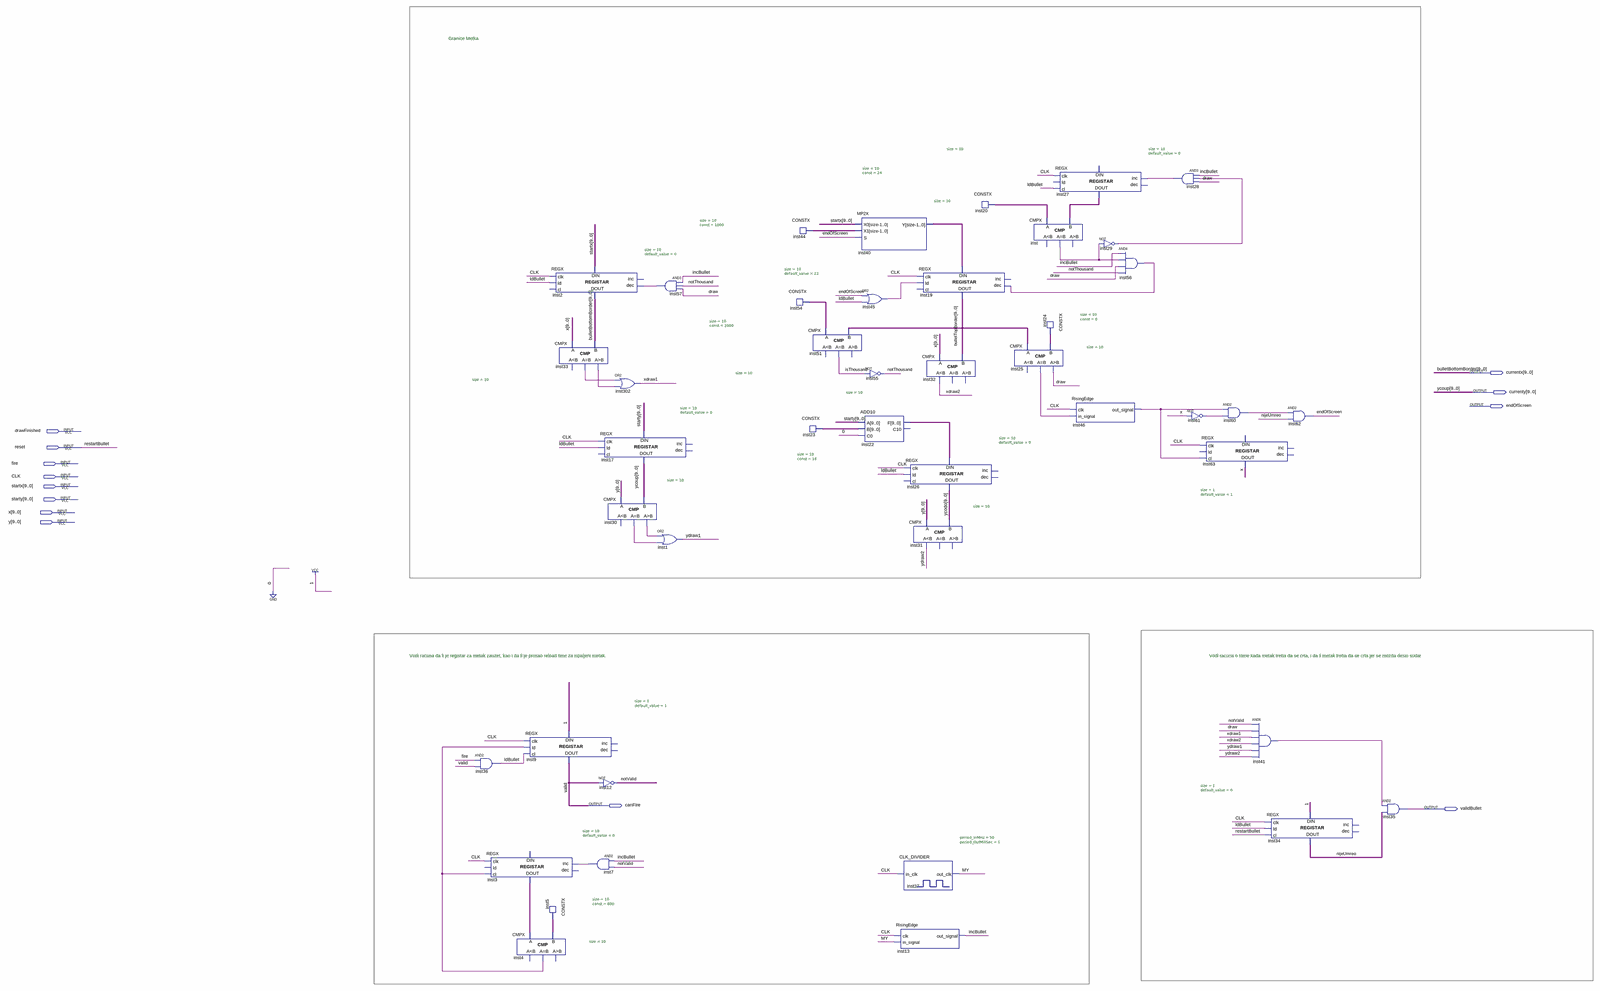
[diagram p0: schematic sheet, whole]
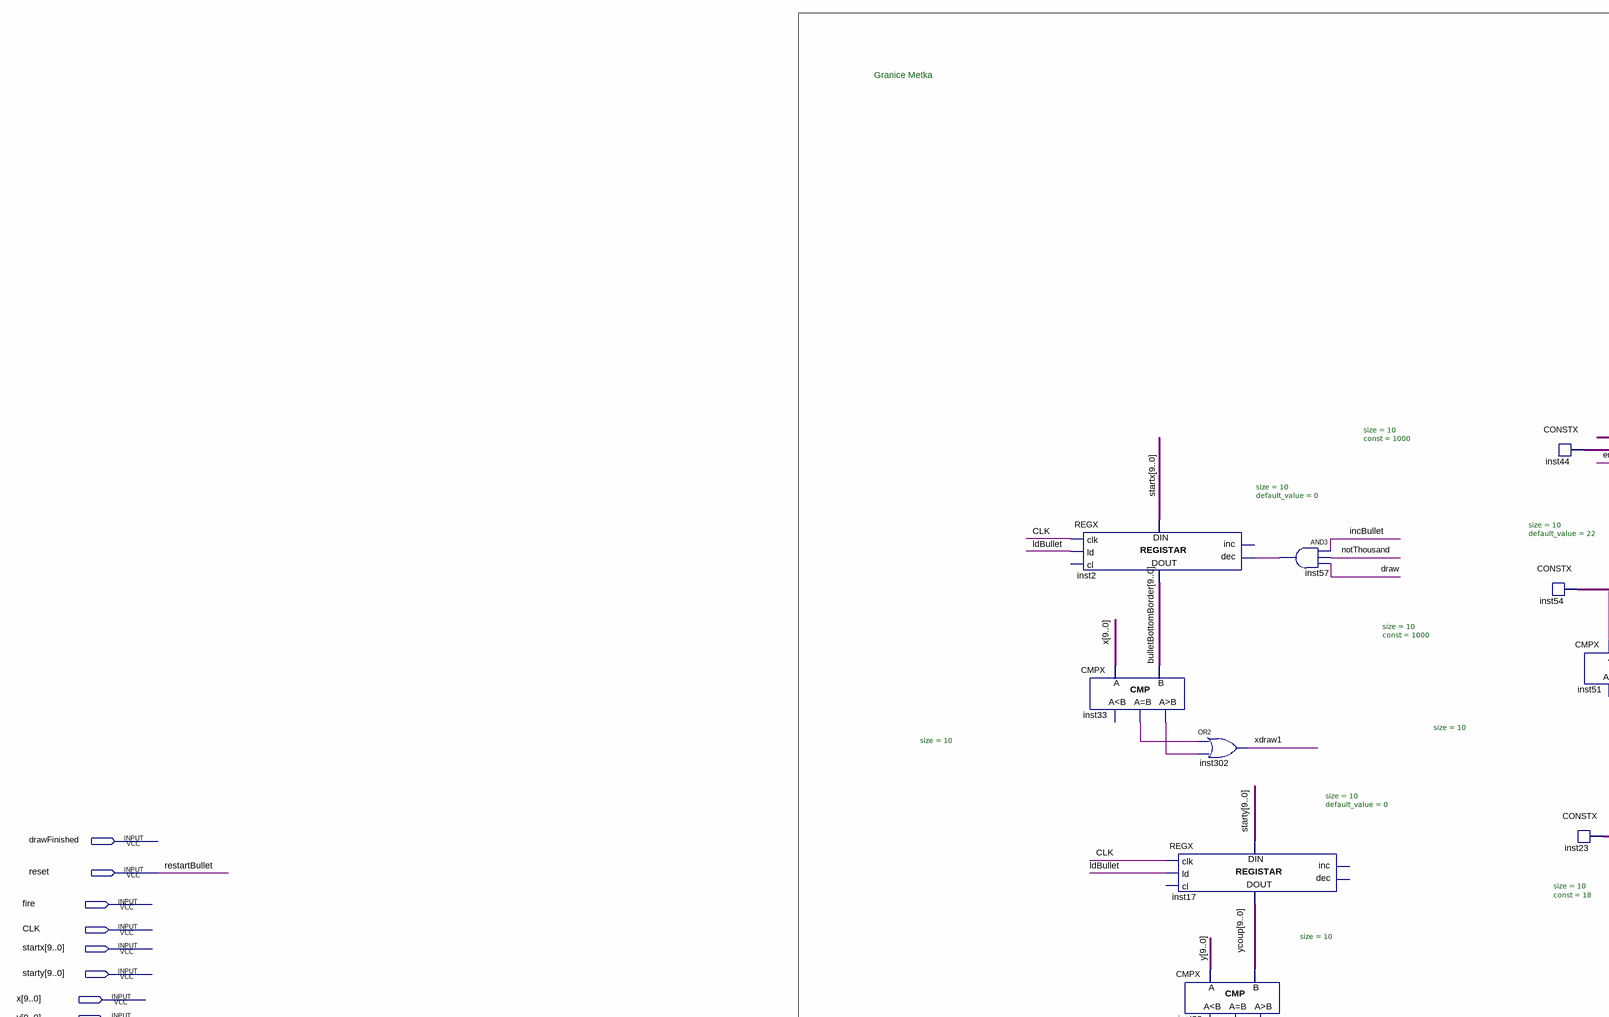
[diagram p1: schematic sheet, upper left part]
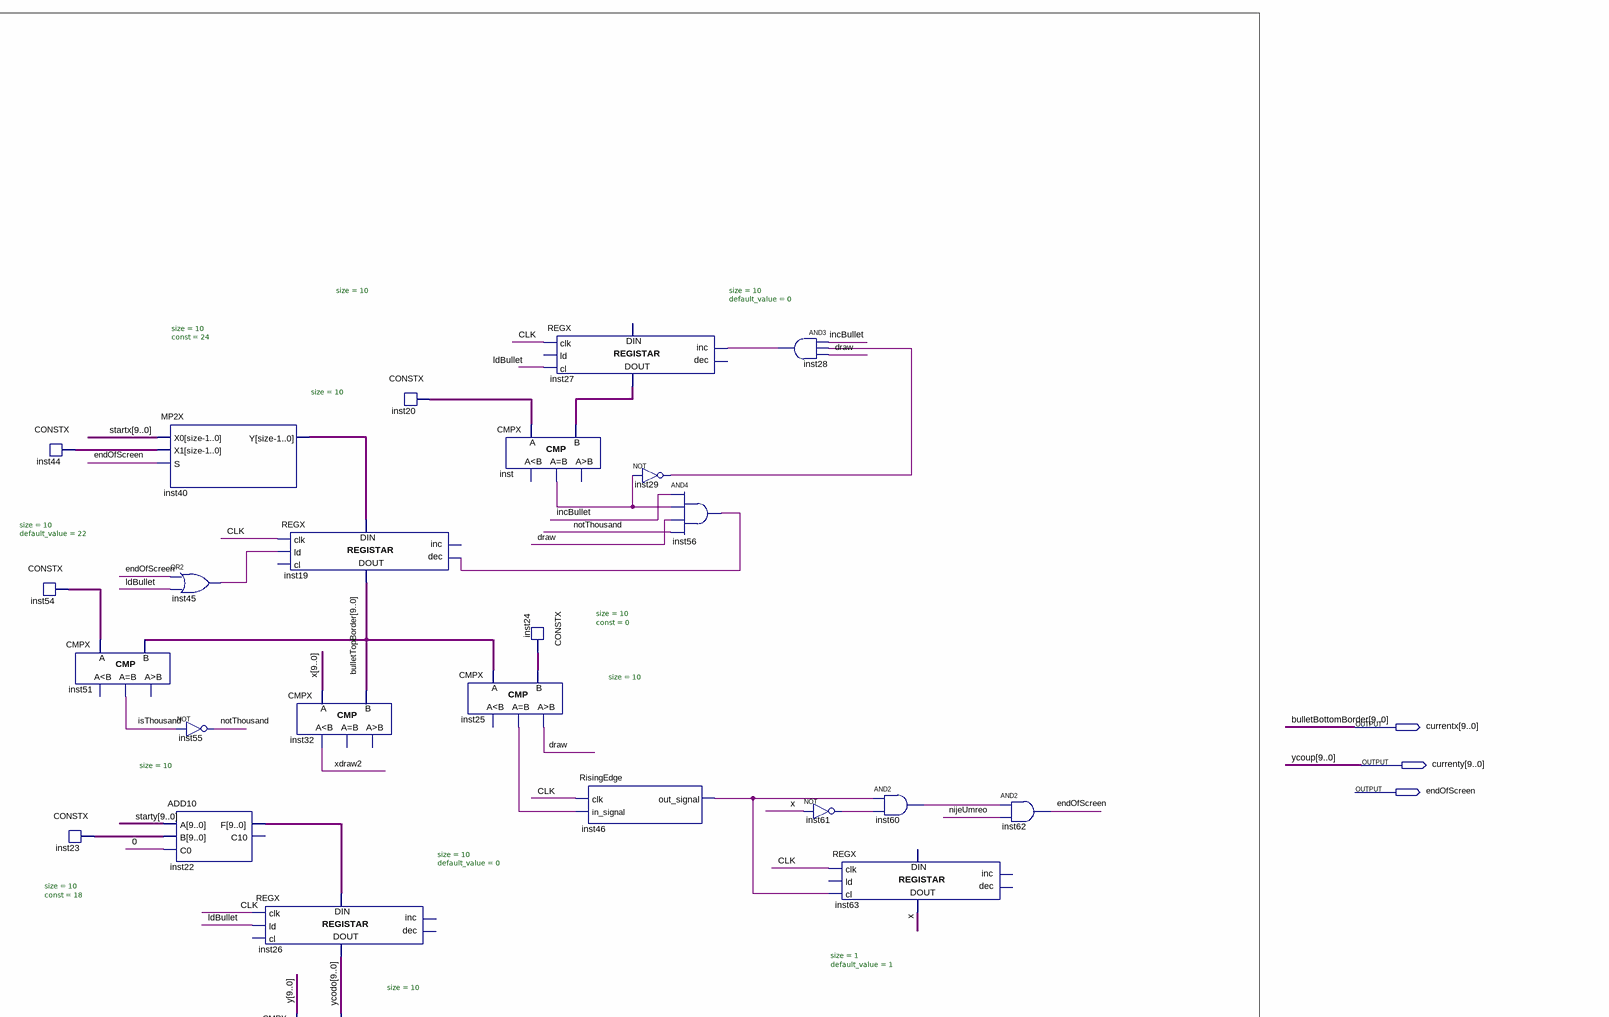
[diagram p2: schematic sheet, upper right part]
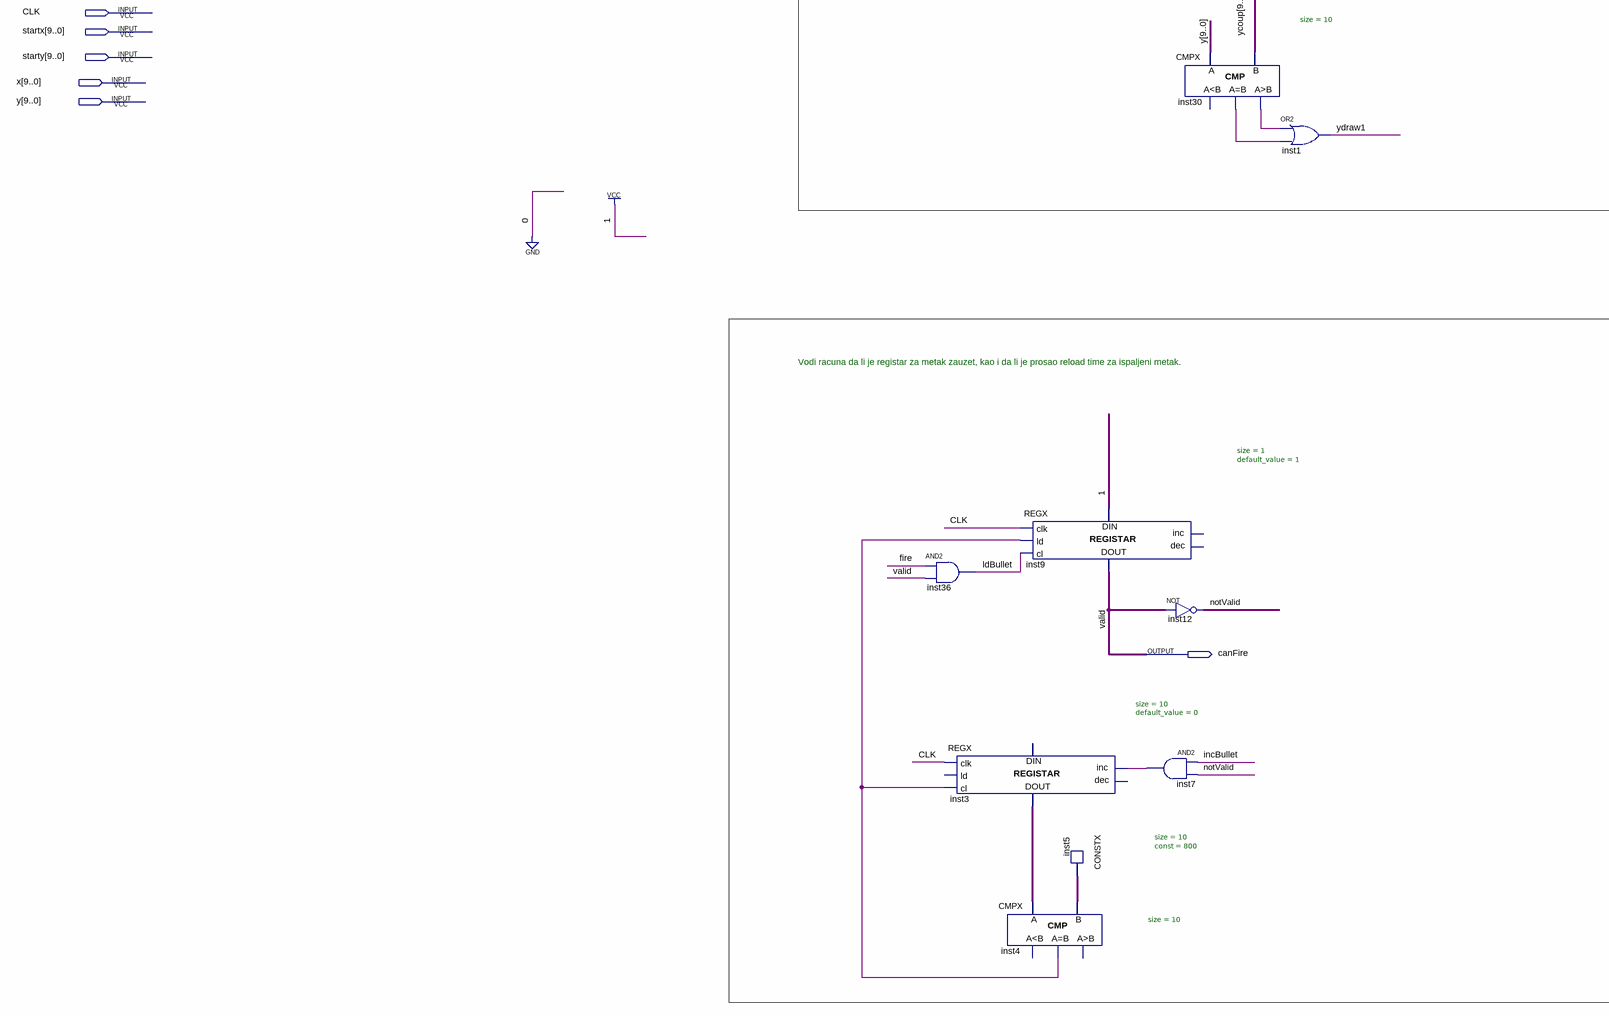
[diagram p3: schematic sheet, lower left part]
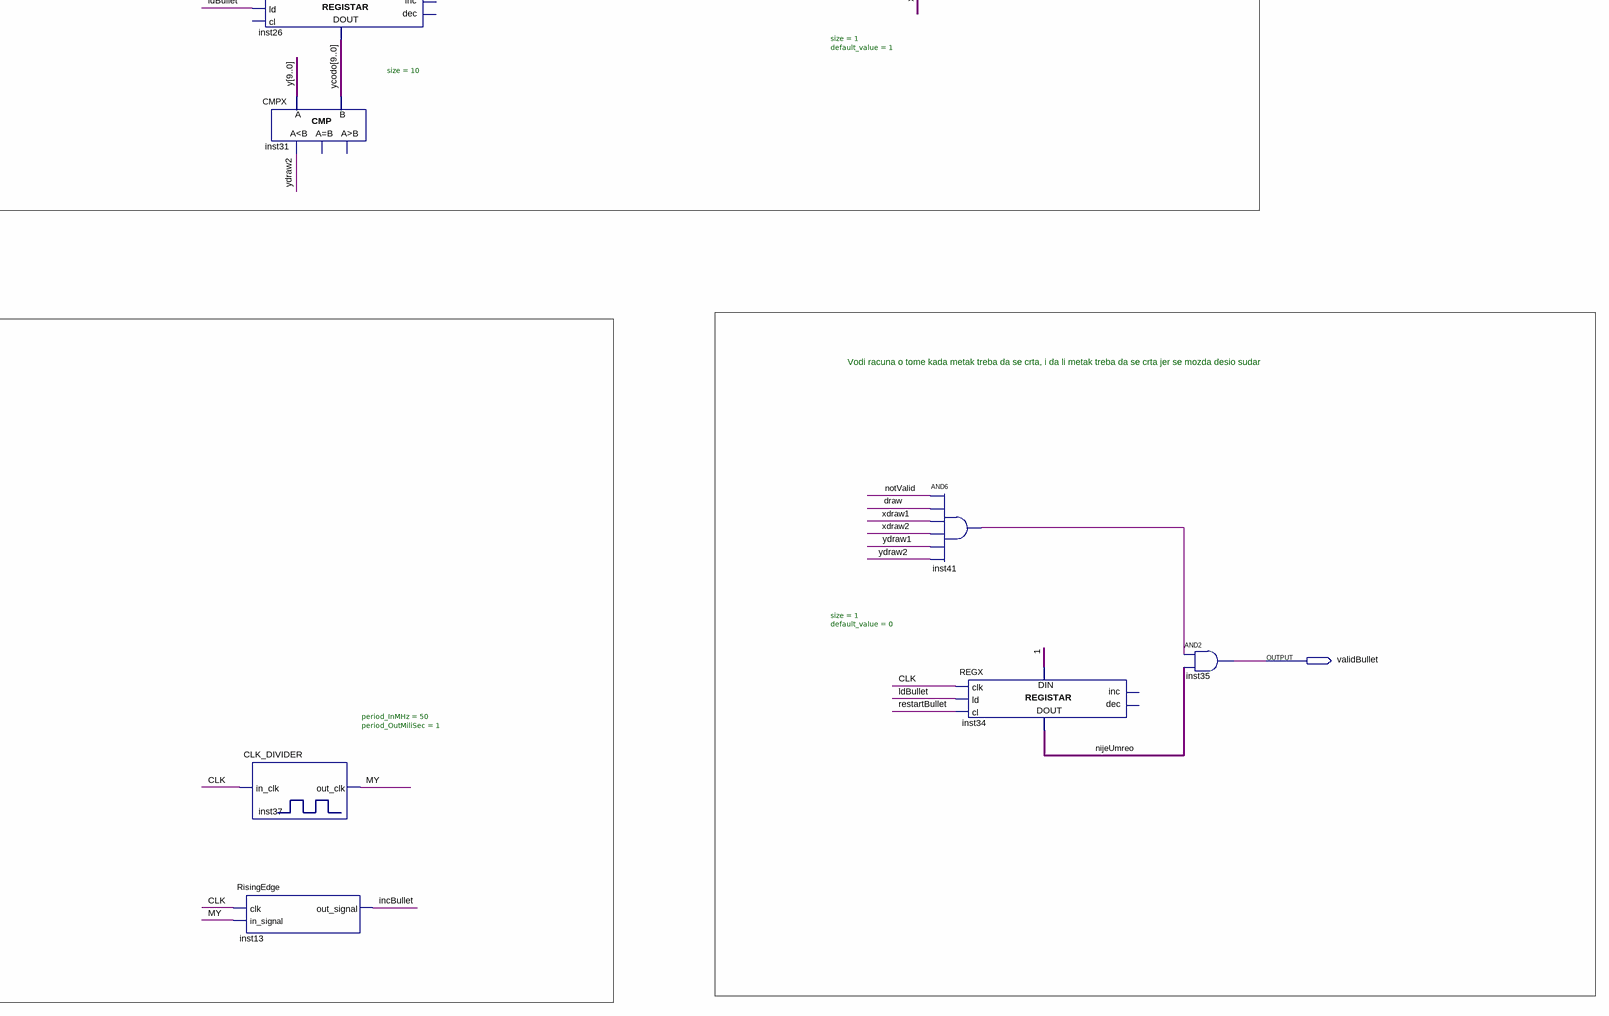
[diagram p4: schematic sheet, lower right part]
// Quartus schematic BulletBadBoy.bdf as structural Verilog: 44 symbols, 13 pins
module BulletBadBoy (
  input  drawFinished,
  input  reset,
  input  fire,
  input  CLK,
  input  [9:0] startx,
  input  [9:0] starty,
  input  [9:0] x,
  input  [9:0] y,
  output [9:0] currentx,
  output [9:0] currenty,
  output endOfScreen,
  output canFire,
  output validBullet
);

  wire draw, incBullet, inst4_eq, inst7_out, inst25_eq, inst28_out, inst29_out, inst30_eq, inst30_gr,
       inst33_eq, inst33_gr, inst41_out, inst45_out, inst46_out_signal, inst56_out, inst57_out, inst60_out,
       inst61_out, inst_eq, isThousand, ldBullet, MY, nijeUmreo, notThousand, notValid, x_1bit, xdraw1,
       xdraw2, ydraw1, ydraw2;
  wire [9:0] bulletTopBorder, inst3_data_out, inst5_data, inst20_data, inst22_f, inst23_data, inst24_data,
       inst27_data_out, inst40_y, inst44_data, inst54_data, ycodo;

  and inst36 (ldBullet, fire, canFire);
  REGX #(.size(10), .default_value(0)) inst3 (
    .clk(CLK), .cl(inst4_eq), .inc(inst7_out), .data_out(inst3_data_out));  // open: ld, dec, data_in
  CMPX #(.size(10)) inst4 (.A(inst3_data_out), .B(inst5_data), .eq(inst4_eq));  // open: ls, gr
  REGX #(.size(1), .default_value(1)) inst9 (
    .clk(CLK), .ld(inst4_eq), .cl(ldBullet), .data_in(1'b1), .data_out(canFire));  // open: inc, dec
  CONSTX #(.size(10), .\const (800)) inst5 (.data(inst5_data));
  REGX #(.size(10), .default_value(0)) inst2 (
    .clk(CLK), .ld(ldBullet), .dec(inst57_out), .data_in(startx), .data_out(currentx));  // open: cl, inc
  CMPX #(.size(10)) inst33 (.A(x), .B(currentx), .eq(inst33_eq), .gr(inst33_gr));  // open: ls
  REGX #(.size(10), .default_value(0)) inst17 (
    .clk(CLK), .ld(ldBullet), .data_in(starty), .data_out(currenty));  // open: cl, inc, dec
  not inst12 (notValid, canFire);
  and inst7 (inst7_out, incBullet, notValid);
  or inst302 (xdraw1, inst33_eq, inst33_gr);
  CMPX #(.size(10)) inst30 (.A(y), .B(currenty), .eq(inst30_eq), .gr(inst30_gr));  // open: ls
  and inst57 (inst57_out, incBullet, notThousand, draw);
  or inst1 (ydraw1, inst30_gr, inst30_eq);
  CONSTX #(.size(10), .\const (1000)) inst44 (.data(inst44_data));
  CONSTX #(.size(10), .\const (1000)) inst54 (.data(inst54_data));
  CMPX #(.size(10)) inst51 (.A(inst54_data), .B(bulletTopBorder), .eq(isThousand));  // open: ls, gr
  CONSTX #(.size(10), .\const (18)) inst23 (.data(inst23_data));
  MP2X #(.size(10)) inst40 (.X0(startx), .X1(inst44_data), .S(endOfScreen), .Y(inst40_y));
  ADD10 inst22 (.A(starty), .B(inst23_data), .C0(1'b0), .F(inst22_f));  // open: C10
  or inst45 (inst45_out, endOfScreen, ldBullet);
  not inst55 (notThousand, isThousand);
  REGX #(.size(10), .default_value(0)) inst26 (
    .clk(CLK), .ld(ldBullet), .data_in(inst22_f), .data_out(ycodo));  // open: cl, inc, dec
  CMPX #(.size(10)) inst31 (.A(y), .B(ycodo), .ls(ydraw2));  // open: eq, gr
  CLK_DIVIDER #(.period_InMHz(50), .period_OutMiliSec(1)) inst37 (.in_clk(CLK), .out_clk(MY));
  RisingEdge inst13 (.clk(CLK), .in_signal(MY), .out_signal(incBullet));
  REGX #(.size(10), .default_value(22)) inst19 (
    .clk(CLK), .ld(inst45_out), .dec(inst56_out), .data_in(inst40_y), .data_out(bulletTopBorder));  // open: cl, inc
  CMPX #(.size(10)) inst32 (.A(x), .B(bulletTopBorder), .ls(xdraw2));  // open: eq, gr
  CONSTX #(.size(10), .\const (24)) inst20 (.data(inst20_data));
  CMPX #(.size(10)) inst25 (.A(bulletTopBorder), .B(inst24_data), .eq(inst25_eq), .gr(draw));  // open: ls
  CMPX #(.size(10)) inst (.A(inst20_data), .B(inst27_data_out), .eq(inst_eq));  // open: ls, gr
  CONSTX #(.size(10), .\const (0)) inst24 (.data(inst24_data));
  REGX #(.size(10), .default_value(0)) inst27 (
    .clk(CLK), .cl(ldBullet), .inc(inst28_out), .data_out(inst27_data_out));  // open: ld, dec, data_in
  RisingEdge inst46 (.clk(CLK), .in_signal(inst25_eq), .out_signal(inst46_out_signal));
  not inst29 (inst29_out, inst_eq);
  and inst56 (inst56_out, incBullet, inst_eq, draw, notThousand);
  and inst28 (inst28_out, incBullet, inst29_out, draw);
  not inst61 (inst61_out, x_1bit);
  and inst60 (inst60_out, inst46_out_signal, inst61_out);
  REGX #(.size(1), .default_value(1)) inst63 (
    .clk(CLK), .cl(inst46_out_signal), .data_out(x_1bit));  // open: ld, inc, dec, data_in
  and inst41 (inst41_out, notValid, draw, xdraw1, xdraw2, ydraw1, ydraw2);
  REGX #(.size(1), .default_value(0)) inst34 (
    .clk(CLK), .ld(ldBullet), .cl(reset), .data_in(1'b1), .data_out(nijeUmreo));  // open: inc, dec
  and inst62 (endOfScreen, inst60_out, nijeUmreo);
  and inst35 (validBullet, inst41_out, nijeUmreo);

  // Other names for the same wires on the sheet: bulletBottomBorder[9:0] = currentx; restartBullet = reset;
  //   valid = canFire; ycoup[9:0] = currenty

  // Notes on the sheet:
  //   Granice Metka                                                                                                                              
  //   Vodi racuna da li je registar za metak zauzet, kao i da li je prosao reload time za ispaljeni metak.
  //   Vodi racuna o tome kada metak treba da se crta, i da li metak treba da se crta jer se mozda desio sudar                      
endmodule
